# Altium project NPU_project.PrjPcb
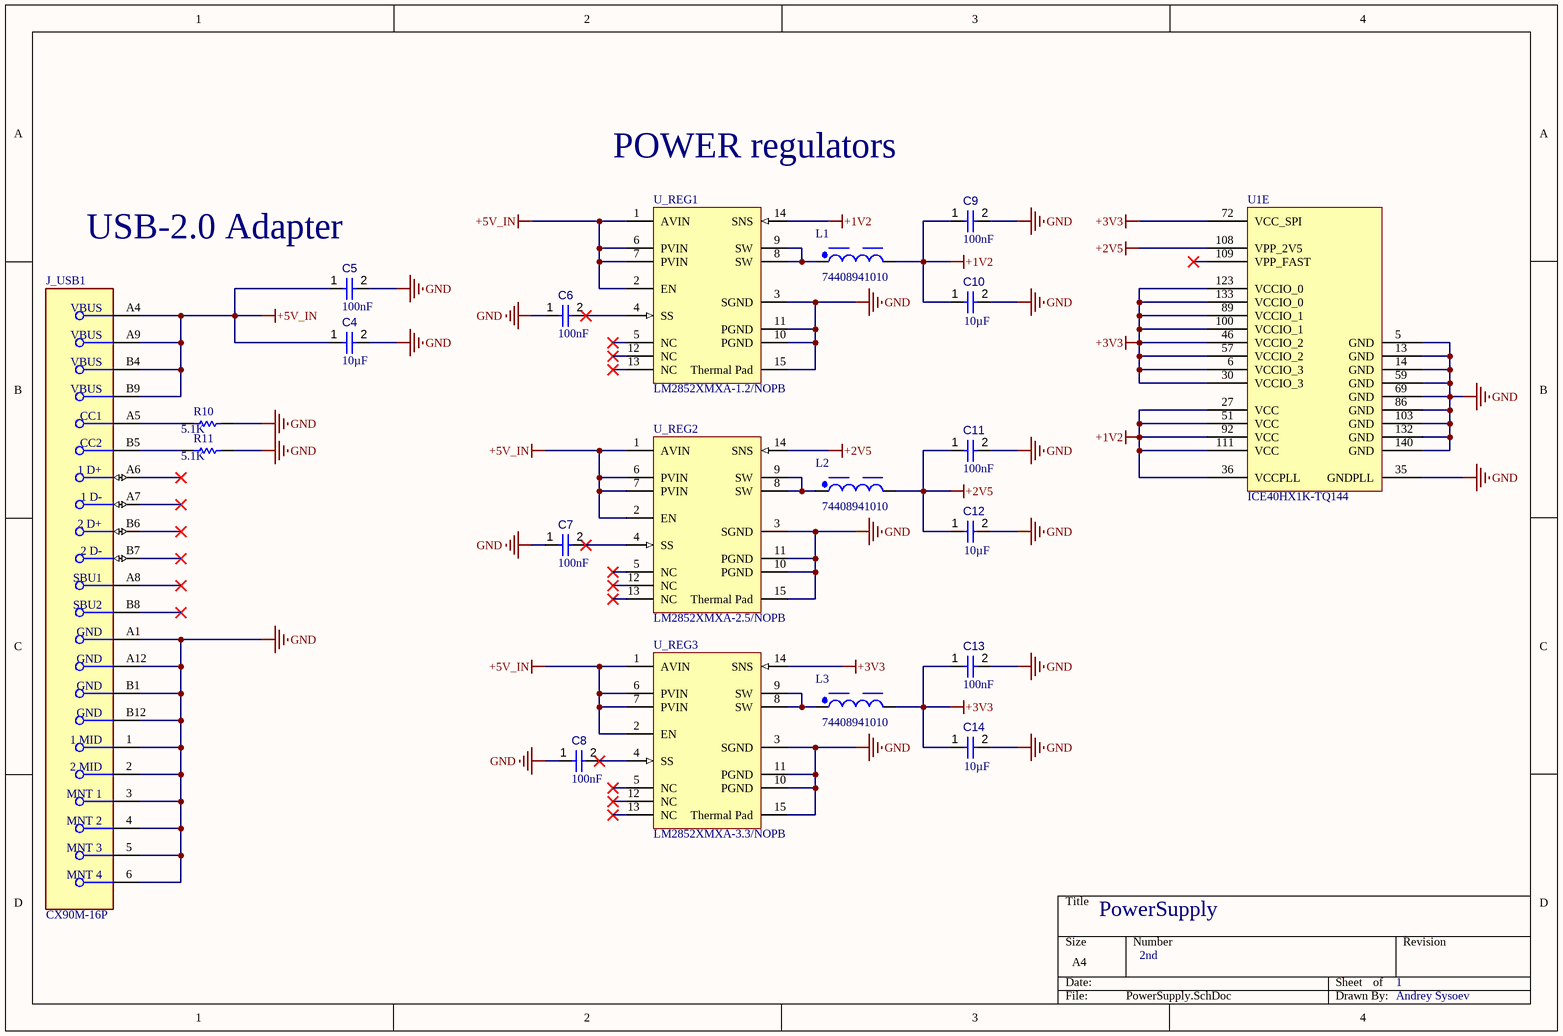
[diagram p0: PowerSupply.SchDoc]
4 sheets, 42 parts. Net scope: flat (ports and power ports of the same name join across sheets).
Board file: NPU_project_ICE40.PcbDoc
Sheets:
  PowerSupply.SchDoc
  Configuration.SchDoc
  Clock.SchDoc
  InputOutput.SchDoc

## Sheet PowerSupply.SchDoc
size A4; SheetNumber: 2; SheetTotal: 5

### Parts
C11  value 100nF  [CAPC0402(1005)60_L]  (hidden comment: Capacitor 100nF +/-20% 50V 0402)
C12  value 10µF  [CAPC0603(1608)100_L]  (hidden comment: Capacitor 10µF +/-20% 10V 0603)
C13  value 100nF  [CAPC0402(1005)60_L]  (hidden comment: Capacitor 100nF +/-20% 50V 0402)
C14  value 10µF  [CAPC0603(1608)100_L]  (hidden comment: Capacitor 10µF +/-20% 10V 0603)
J_USB1  CX90M-16P  [FP-CX90M-16P-MFG]
L1  74408941010  [WE-SPC_4818]
L2  74408941010  [WE-SPC_4818]
L3  74408941010  [WE-SPC_4818]
R10  5.1K  [RESC2512(6432)_M]
R11  5.1K  [RESC2512(6432)_M]
U1  ICE40HX1K-TQ144  [LATC-TQFP-144_N]  (part E of 6)
U_REG1  LM2852XMXA-1.2/NOPB  [MXA14A_N]
U_REG2  LM2852XMXA-2.5/NOPB  [MXA14A_N]
U_REG3  LM2852XMXA-3.3/NOPB  [MXA14A_N]
С4  value 10µF  [CAPC0603(1608)100_L]  (hidden comment: Capacitor 10µF +/-20% 10V 0603)
С5  value 100nF  [CAPC0402(1005)60_L]  (hidden comment: Capacitor 100nF +/-20% 50V 0402)
С6  value 100nF  [CAPC0402(1005)60_L]  (hidden comment: Capacitor 100nF +/-20% 50V 0402)
С7  value 100nF  [CAPC0402(1005)60_L]  (hidden comment: Capacitor 100nF +/-20% 50V 0402)
С8  value 100nF  [CAPC0402(1005)60_L]  (hidden comment: Capacitor 100nF +/-20% 50V 0402)
С9  value 100nF  [CAPC0402(1005)60_L]  (hidden comment: Capacitor 100nF +/-20% 50V 0402)
С10  value 10µF  [CAPC0603(1608)100_L]  (hidden comment: Capacitor 10µF +/-20% 10V 0603)

### Nets
+1V2: L1.2 U1.27(VCC) U1.36(VCCPLL) U1.51(VCC) U1.92(VCC) U1.111(VCC) U_REG1.14(SNS) С9.1 С10.1
+2V5: C11.1 C12.1 L2.2 U1.108(VPP_2V5) U_REG2.14(SNS)
+3V3: C13.1 C14.1 L3.2 U1.6(VCCIO_3) U1.30(VCCIO_3) U1.46(VCCIO_2) U1.57(VCCIO_2) U1.72(VCC_SPI) U1.89(VCCIO_1) U1.100(VCCIO_1) U1.123(VCCIO_0) U1.133(VCCIO_0) U_REG3.14(SNS)
+5V_IN: J_USB1.A4(VBUS) J_USB1.A9(VBUS) J_USB1.B4(VBUS) J_USB1.B9(VBUS) U_REG1.1(AVIN) U_REG1.2(EN) U_REG1.6(PVIN) U_REG1.7(PVIN) U_REG2.1(AVIN) U_REG2.2(EN) U_REG2.6(PVIN) U_REG2.7(PVIN) U_REG3.1(AVIN) U_REG3.2(EN) U_REG3.6(PVIN) U_REG3.7(PVIN) С4.1 С5.1
GND: C11.2 C12.2 C13.2 C14.2 J_USB1.1(1_MID) J_USB1.2(2_MID) J_USB1.3(MNT_1) J_USB1.4(MNT_2) J_USB1.5(MNT_3) J_USB1.6(MNT_4) J_USB1.A1(GND) J_USB1.A12(GND) J_USB1.B1(GND) J_USB1.B12(GND) R10.2 R11.2 U1.5(GND) U1.13(GND) U1.14(GND) U1.35(GNDPLL) U1.59(GND) U1.69(GND) U1.86(GND) U1.103(GND) U1.132(GND) U1.140(GND) U_REG1.3(SGND) U_REG1.10(PGND) U_REG1.11(PGND) U_REG1.15(Thermal_Pad) U_REG2.3(SGND) U_REG2.10(PGND) U_REG2.11(PGND) U_REG2.15(Thermal_Pad) U_REG3.3(SGND) U_REG3.10(PGND) U_REG3.11(PGND) U_REG3.15(Thermal_Pad) С4.2 С5.2 С6.1 С7.1 С8.1 С9.2 С10.2
NetJ_USB1_A5: J_USB1.A5(CC1) R10.1
NetJ_USB1_B5: J_USB1.B5(CC2) R11.1
NetL1_1: L1.1 U_REG1.8(SW) U_REG1.9(SW)
NetL2_1: L2.1 U_REG2.8(SW) U_REG2.9(SW)
NetL3_1: L3.1 U_REG3.8(SW) U_REG3.9(SW)
NetU_REG1_4: U_REG1.4(SS) С6.2
NetU_REG2_4: U_REG2.4(SS) С7.2
NetU_REG3_4: U_REG3.4(SS) С8.2

Not connected (* = marked no-connect by the designer): J_USB1 A6(1_D+)* A7(1_D-)* A8(SBU1)* B6(2_D+)* B7(2_D-)* B8(SBU2)*; U1 109(VPP_FAST)*; U_REG1 5(NC)* 12(NC)* 13(NC)*; U_REG2 5(NC)* 12(NC)* 13(NC)*; U_REG3 5(NC)* 12(NC)* 13(NC)*

### Notes on the sheet
- POWER regulators
- (near С5) USB-2.0 Adapter
- PowerSupply
- 2nd
- 1
- Andrey Sysoev

### Library data of the parts
C11 C13 С5-С9 = CMP-001-00067-3: Chip Capacitor, 100nF +/-20%, 50V, 0402, Thickness 0.6 mm; Tolerance: 10%; Min Operating Temperature: -55°C; Pins: 2; Case/Package: 0402; Max Operating Temperature: 85°C; Voltage Rating: 50V; Mounting Technology: SMT
C12 C14 С4 С10 = CMP-001-00075-4: Chip Capacitor, 10µF +/-20%, 10V, 0603, Thickness 1 mm; Tolerance: 10%; Voltage Rating: 10V; Max Operating Temperature: 85°C; Pins: 2; Case/Package: 0603; Mounting Technology: SMT; Min Operating Temperature: -55°C
J_USB1 = CMP-031-00012-1: USB Connector, USB Type C, USB 2.0, Receptacle, 16 Ways, Surface Mount, Right Angle; Pins: 16; Max Operating Temperature: 85°C; Min Operating Temperature: -40°C
L1-L3 = CMP-031-00017-1: Power Choke Shielded Wirewound 1uH 20% 100KHz Ferrite 3A 0.0295Ohm DCR T/R; Max Operating Temperature: 125°C; Pins: 2; Min Operating Temperature: -40°C
R10 R11 = CMP-031-00013-1: Fixed Resistor, Metal Glaze/Thick Film, 1W, 5.1ohm, 500V, 5% +/-Tol, Surface Mount, 2512; Mounting Technology: Surface Mount; Min Operating Temperature: -55°C; Case/Package: 2512; Max Operating Temperature: 155°C
U1 = CMP-031-00018-1: FPGA iCE40 HX Family 1280 Cells 40nm Technology 1.2V 144-Pin TQFP Tray; Max Supply Voltage: 1.26V; Min Supply Voltage: 1.14V; Pins: 144; Case/Package: LFQFP; Max Operating Temperature: 85°C; Min Operating Temperature: -40°C
U_REG1 = CMP-031-00019-1: 2A 500/1500kHz Synchronous Buck Regulator 14-HTSSOP -40 to 125; Max Supply Voltage: 5.5V; Pins: 14; Max Operating Temperature: 125°C; Case/Package: HTSSOP EP; Mounting Technology: Surface Mount; Min Operating Temperature: -40°C
U_REG2 = CMP-031-00020-1: 2A 500/1500kHz Synchronous Buck Regulator 14-HTSSOP -40 to 125; Max Supply Voltage: 5.5V; Min Supply Voltage: 2.85V; Max Operating Temperature: 125°C; Mounting Technology: Surface Mount; Pins: 14; Min Operating Temperature: -40°C; Case/Package: HTSSOP EP
U_REG3 = CMP-031-00015-1: 2A 500/1500kHz Synchronous Buck Regulator 14-HTSSOP -40 to 125; Min Supply Voltage: 2.85V; Max Supply Voltage: 5.5V; Max Operating Temperature: 125°C; Case/Package: HTSSOP EP; Min Operating Temperature: -40°C; Pins: 14; Mounting Technology: Surface Mount

## Sheet Configuration.SchDoc
size 127 x 88 mm; SheetNumber: 3; SheetTotal: 5
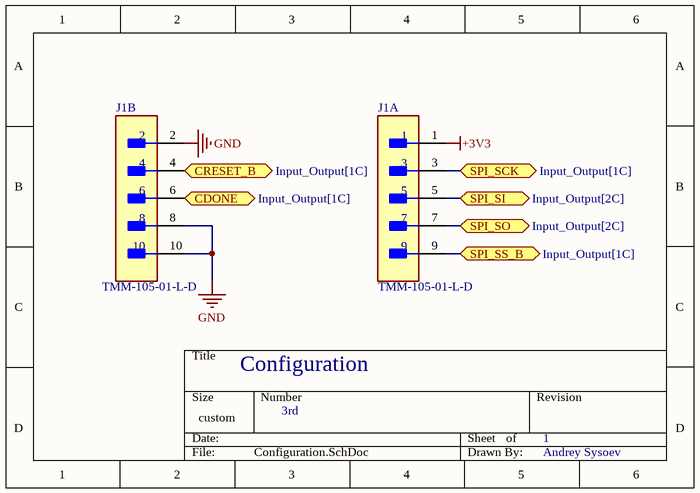
[diagram p1: Configuration.SchDoc]

### Parts
J1  TMM-105-01-L-D  [FP-TMM-105-01-L-D-MFG]  (parts A,B of 2)

### Ports
CDONE (bidir, see Input_Output[1C]), CRESET_B (bidir, see Input_Output[1C]), SPI_SCK (bidir, see Input_Output[1C]), SPI_SI (bidir, see Input_Output[2C]), SPI_SO (bidir, see Input_Output[2C]), SPI_SS_B (bidir, see Input_Output[1C])

### Nets
+3V3: J1.1
GND: J1.2 J1.8 J1.10
NetJ1_3: J1.3 ; port SPI_SCK
NetJ1_4: J1.4 ; port CRESET_B
NetJ1_5: J1.5 ; port SPI_SI
NetJ1_6: J1.6 ; port CDONE
NetJ1_7: J1.7 ; port SPI_SO
NetJ1_9: J1.9 ; port SPI_SS_B

### Notes on the sheet
- Configuration
- 3rd
- 1
- Andrey Sysoev

### Library data of the parts
J1 = CMP-031-00007-1: TMM ROHS3Compliant COMMERCIAL 2012 Connector Header -55C~125C 3.2A per Contact 500V 3.94mm; Max Operating Temperature: 125°C; Min Operating Temperature: -55°C

## Sheet Clock.SchDoc
size 101 x 76 mm; SheetNumber: 4; SheetTotal: 5
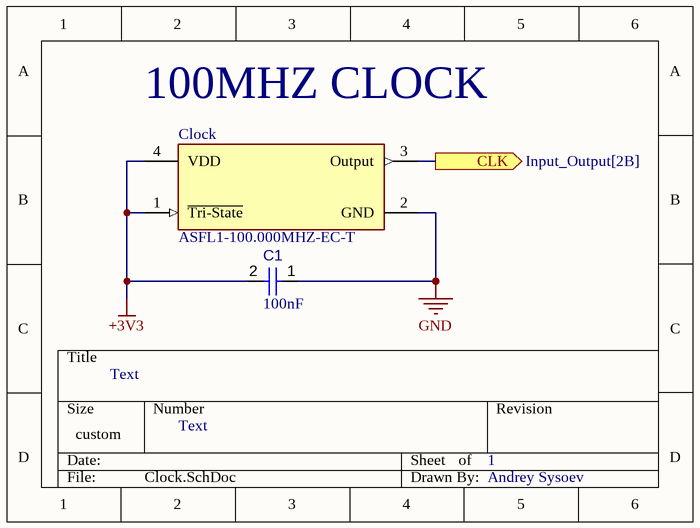
[diagram p2: Clock.SchDoc]

### Parts
Clock  ASFL1-100.000MHZ-EC-T  [FP-ASFL1-MFG]
С1  value 100nF  [CAPC0402(1005)60_L]  (hidden comment: Capacitor 100nF +/-20% 50V 0402)

### Ports
CLK (out, see Input_Output[2B])

### Nets
+3V3: Clock.1(~{Tri-State}) Clock.4(VDD) С1.2
GND: Clock.2(GND) С1.1
NetClock_3: Clock.3(Output) ; port CLK

### Notes on the sheet
- (near Clock) 100MHZ CLOCK
- Text
- 1
- Andrey Sysoev

### Library data of the parts
Clock = CMP-031-00009-1: Oscillator Xo 100MHZ ±50PPM 15PF Hcmos/ttl 60% 3.3V 4-PIN SMD T/r; Min Supply Voltage: 2.97V; Max Supply Voltage: 3.63V; Mounting Technology: Surface Mount; Case/Package: SMD/SMT; Max Operating Temperature: 70°C; Pins: 4; Min Operating Temperature: -20°C
С1 = CMP-001-00067-3: as C11 on sheet PowerSupply; Min Operating Temperature: -55°C; Pins: 2; Case/Package: 0402; Max Operating Temperature: 85°C; Voltage Rating: 50V; Mounting Technology: SMT

## Sheet InputOutput.SchDoc
size 279 x 177 mm; SheetNumber: 5; SheetTotal: 5
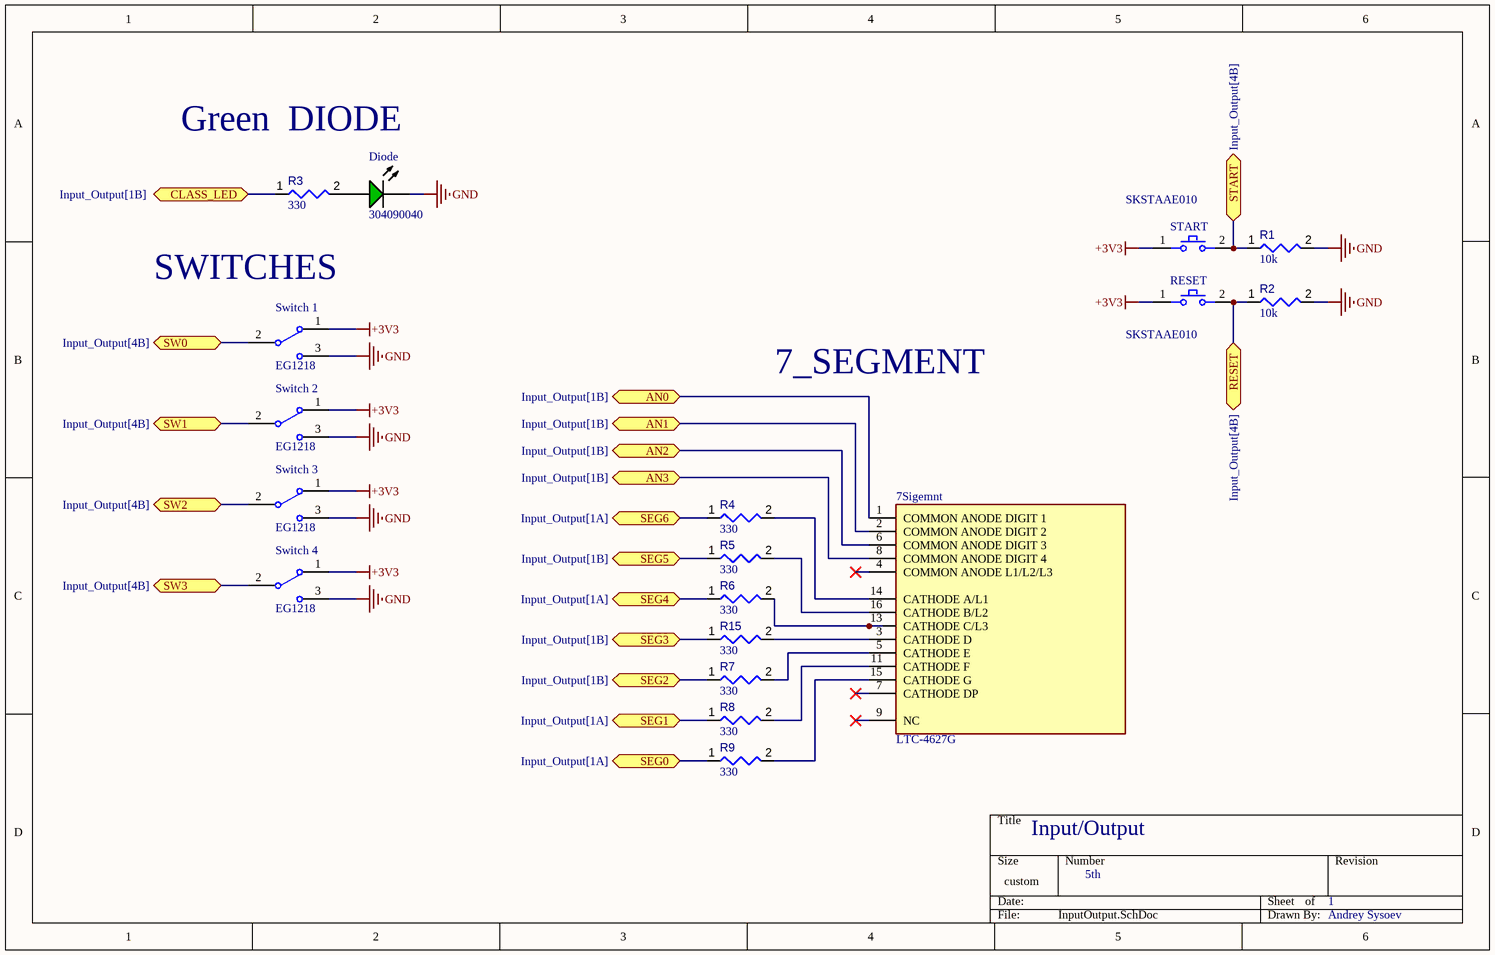
[diagram p3: InputOutput.SchDoc]

### Parts
7Sigemnt  LTC-4627G  [FP-LTC-4627G-MFG]
Diode  304090040  [LED-2P-2.28-3MM]
R1  value 10k  [RESC0402(1005)_L]  (hidden comment: 10KR2F)
R2  value 10k  [RESC0402(1005)_L]  (hidden comment: 10KR2F)
R3  value 330  [RESC0402(1005)_L]  (hidden comment: 330R2J)
R4  value 330  [RESC0402(1005)_L]  (hidden comment: 330R2J)
R5  value 330  [RESC0402(1005)_L]  (hidden comment: 330R2J)
R6  value 330  [RESC0402(1005)_L]  (hidden comment: 330R2J)
R7  value 330  [RESC0402(1005)_L]  (hidden comment: 330R2J)
R8  value 330  [RESC0402(1005)_L]  (hidden comment: 330R2J)
R9  value 330  [RESC0402(1005)_L]  (hidden comment: 330R2J)
R15  value 330  [RESC0402(1005)_L]  (hidden comment: 330R2J)
RESET  SKSTAAE010  [FP-SKSTAAE010-MFG]
START  SKSTAAE010  [FP-SKSTAAE010-MFG]
Switch_1  EG1218  [ESWI-EG1218_V]
Switch_2  EG1218  [ESWI-EG1218_V]
Switch_3  EG1218  [ESWI-EG1218_V]
Switch_4  EG1218  [ESWI-EG1218_V]

### Ports
AN0 (bidir, see Input_Output[1B]), AN1 (bidir, see Input_Output[1B]), AN2 (bidir, see Input_Output[1B]), AN3 (bidir, see Input_Output[1B]), CLASS_LED (bidir, see Input_Output[1B]), RESET (bidir, see Input_Output[4B]), SEG0 (bidir, see Input_Output[1A]), SEG1 (bidir, see Input_Output[1A]), SEG2 (bidir, see Input_Output[1B]), SEG3 (bidir, see Input_Output[1B]), SEG4 (bidir, see Input_Output[1A]), SEG5 (bidir, see Input_Output[1B]), SEG6 (bidir, see Input_Output[1A]), START (bidir, see Input_Output[4B]), SW0 (bidir, see Input_Output[4B]), SW1 (bidir, see Input_Output[4B]), SW2 (bidir, see Input_Output[4B]), SW3 (bidir, see Input_Output[4B])

### Nets
+3V3: RESET.1 START.1 Switch_1.1 Switch_2.1 Switch_3.1 Switch_4.1
GND: Diode.2(K) R1.2 R2.2 Switch_1.3 Switch_2.3 Switch_3.3 Switch_4.3
Net7Sigemnt_1: 7Sigemnt.1(COMMON_ANODE_DIGIT_1) ; port AN0
Net7Sigemnt_2: 7Sigemnt.2(COMMON_ANODE_DIGIT_2) ; port AN1
Net7Sigemnt_3: 7Sigemnt.3(CATHODE_D) R15.2
Net7Sigemnt_5: 7Sigemnt.5(CATHODE_E) R7.2
Net7Sigemnt_6: 7Sigemnt.6(COMMON_ANODE_DIGIT_3) ; port AN2
Net7Sigemnt_8: 7Sigemnt.8(COMMON_ANODE_DIGIT_4) ; port AN3
Net7Sigemnt_11: 7Sigemnt.11(CATHODE_F) R8.2
Net7Sigemnt_13: 7Sigemnt.13(CATHODE_C/L3) R6.2
Net7Sigemnt_14: 7Sigemnt.14(CATHODE_A/L1) R4.2
Net7Sigemnt_15: 7Sigemnt.15(CATHODE_G) R9.2
Net7Sigemnt_16: 7Sigemnt.16(CATHODE_B/L2) R5.2
NetDiode_1: Diode.1(A) R3.2
NetR1_1: R1.1 START.2 ; port START
NetR2_1: R2.1 RESET.2 ; port RESET
NetR3_1: R3.1 ; port CLASS_LED
NetR4_1: R4.1 ; port SEG6
NetR5_1: R5.1 ; port SEG5
NetR6_1: R6.1 ; port SEG4
NetR7_1: R7.1 ; port SEG2
NetR8_1: R8.1 ; port SEG1
NetR9_1: R9.1 ; port SEG0
NetR15_1: R15.1 ; port SEG3
NetSwitch_1_2: Switch_1.2(COM) ; port SW0
NetSwitch_2_2: Switch_2.2(COM) ; port SW1
NetSwitch_3_2: Switch_3.2(COM) ; port SW2
NetSwitch_4_2: Switch_4.2(COM) ; port SW3

Not connected (* = marked no-connect by the designer): 7Sigemnt 4(COMMON_ANODE_L1/L2/L3)* 7(CATHODE_DP)* 9(NC)*

### Notes on the sheet
- Green  DIODE
- SWITCHES
- 7_SEGMENT
- Input/Output
- 5th
- 1
- Andrey Sysoev

### Library data of the parts
7Sigemnt = CMP-031-00011-1: 7 Seg Numeric LED Display, 4-Character, Green, 10mm; Max Operating Temperature: 85°C; Mounting Technology: Through Hole; Case/Package: PDIP; Min Operating Temperature: -35°C; Pins: 14
Diode = CMP-007-00006-2: Green LED, 80 mW, 20 mA, -25 to 85 degC, 2-Pin THD; Manufacturer: Shenzhen CGX; Manufacturer URL: http://szcgx.com/; Package Reference: 304090040; Datasheet Version: Rev. 1.0, 09/2014; RoHS Compliant: Unknown; Case/Package: 304090040; Package Description: 2-Pin Through Hole Device, Dia 3 mm, Pitch 2.28 mm; Datasheet URL: http://datasheet.octopart.com/304090040-Chengguangxing-datasheet-62330655.pdf; Mounting Technology: TH
R1 R2 = CMP-009-00066-2: 10K 0.063W 1% 0402 (1005 Metric)  SMD; Power: 63mW; Case/Package: 0402; Mounting Technology: SMT; Pins: 2; Tolerance: 1%
R3-R9 R15 = CMP-009-00095-2: 330R 0.063W 5% 0402 (1005 Metric)  SMD; Power: 63mW; Tolerance: 5%; Mounting Technology: SMT; Case/Package: 0402; Pins: 2
RESET START = CMP-031-00010-1: Switch Tactile N.O. SPST Round Button J-Bend 0.05A 16VDC 500000Cycles 4N SMD T/R; Max Operating Temperature: 90°C; Min Operating Temperature: -40°C; Mounting Technology: Surface Mount
Switch_1-Switch_4 = CMP-011-00006-2: Slide Switch, SPDT, 500 V, -20 to 70 degC, 3-Pin THD, RoHS, Bulk; Manufacturer: E-Switch; Voltage Rating (DC): 30V; Current Rating: 200mA; Operating Force: 250gf; Package Quantity: 1000; Contact Plating: Silver; Max Operating Temperature: 70°C; Min Operating Temperature: -20°C; Contact Material: Copper; Datasheet URL: https://www.e-switch.com/system/asset/product_line/data_sheet/119/EG.pdf; Contact Finish: Silver; Case/Package: EG1218; Voltage Rating (AC): 30V; Datasheet Version: Oct-15; Package Description: 3-Pin Through Hole Device, Body 11.6 x 4 mm, Pitch 2.5 mm; RoHS Compliant: True; Package Reference: EG1218; Manufacturer URL: http://www.e-switch.ch/en/; Throw Configuration: SPDT; Contact Current Rating: 200mA; Mounting Technology: TH; Packaging: Bulk; Pins: 3

## Nets that join several sheets
+3V3: PowerSupply (13 pins), Configuration (J1.1), Clock (Clock.1 Clock.4 С1.2), InputOutput (6 pins)
GND: PowerSupply (45 pins), Configuration (J1.2 J1.8 J1.10), Clock (Clock.2 С1.1), InputOutput (7 pins)